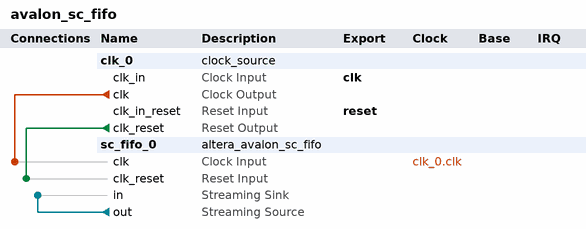
[diagram p0: system contents]
# Platform Designer (Qsys) system avalon_sc_fifo, Cyclone V 5CSXFC6D6F31I7
# Parameters at their usual value, and those the tool derives, are not listed.
package require -exact qsys 19.1
create_system avalon_sc_fifo
set_project_property DEVICE_FAMILY {Cyclone V}
set_project_property DEVICE 5CSXFC6D6F31I7

add_instance clk_0 clock_source 19.1
set_instance_parameter_value clk_0 clockFrequency 50000000

add_instance sc_fifo_0 altera_avalon_sc_fifo 19.1
set_instance_parameter_value sc_fifo_0 BITS_PER_SYMBOL 8
set_instance_parameter_value sc_fifo_0 CHANNEL_WIDTH 0
set_instance_parameter_value sc_fifo_0 ERROR_WIDTH 0
set_instance_parameter_value sc_fifo_0 FIFO_DEPTH 16
set_instance_parameter_value sc_fifo_0 USE_FILL_LEVEL 1
set_instance_parameter_value sc_fifo_0 USE_MEMORY_BLOCKS 1
set_instance_parameter_value sc_fifo_0 USE_STORE_FORWARD 1

# connections
add_connection clk_0.clk sc_fifo_0.clk clock
add_connection clk_0.clk_reset sc_fifo_0.clk_reset reset
add_connection sc_fifo_0.out sc_fifo_0.in avalon_streaming

# exported interfaces
add_interface clk clock sink
set_interface_property clk EXPORT_OF clk_0.clk_in
add_interface reset reset sink
set_interface_property reset EXPORT_OF clk_0.clk_in_reset

set_interconnect_requirement {$system} qsys_mm.clockCrossingAdapter HANDSHAKE
set_interconnect_requirement {$system} qsys_mm.enableEccProtection FALSE
set_interconnect_requirement {$system} qsys_mm.insertDefaultSlave FALSE
set_interconnect_requirement {$system} qsys_mm.maxAdditionalLatency 1

save_system avalon_sc_fifo.qsys
